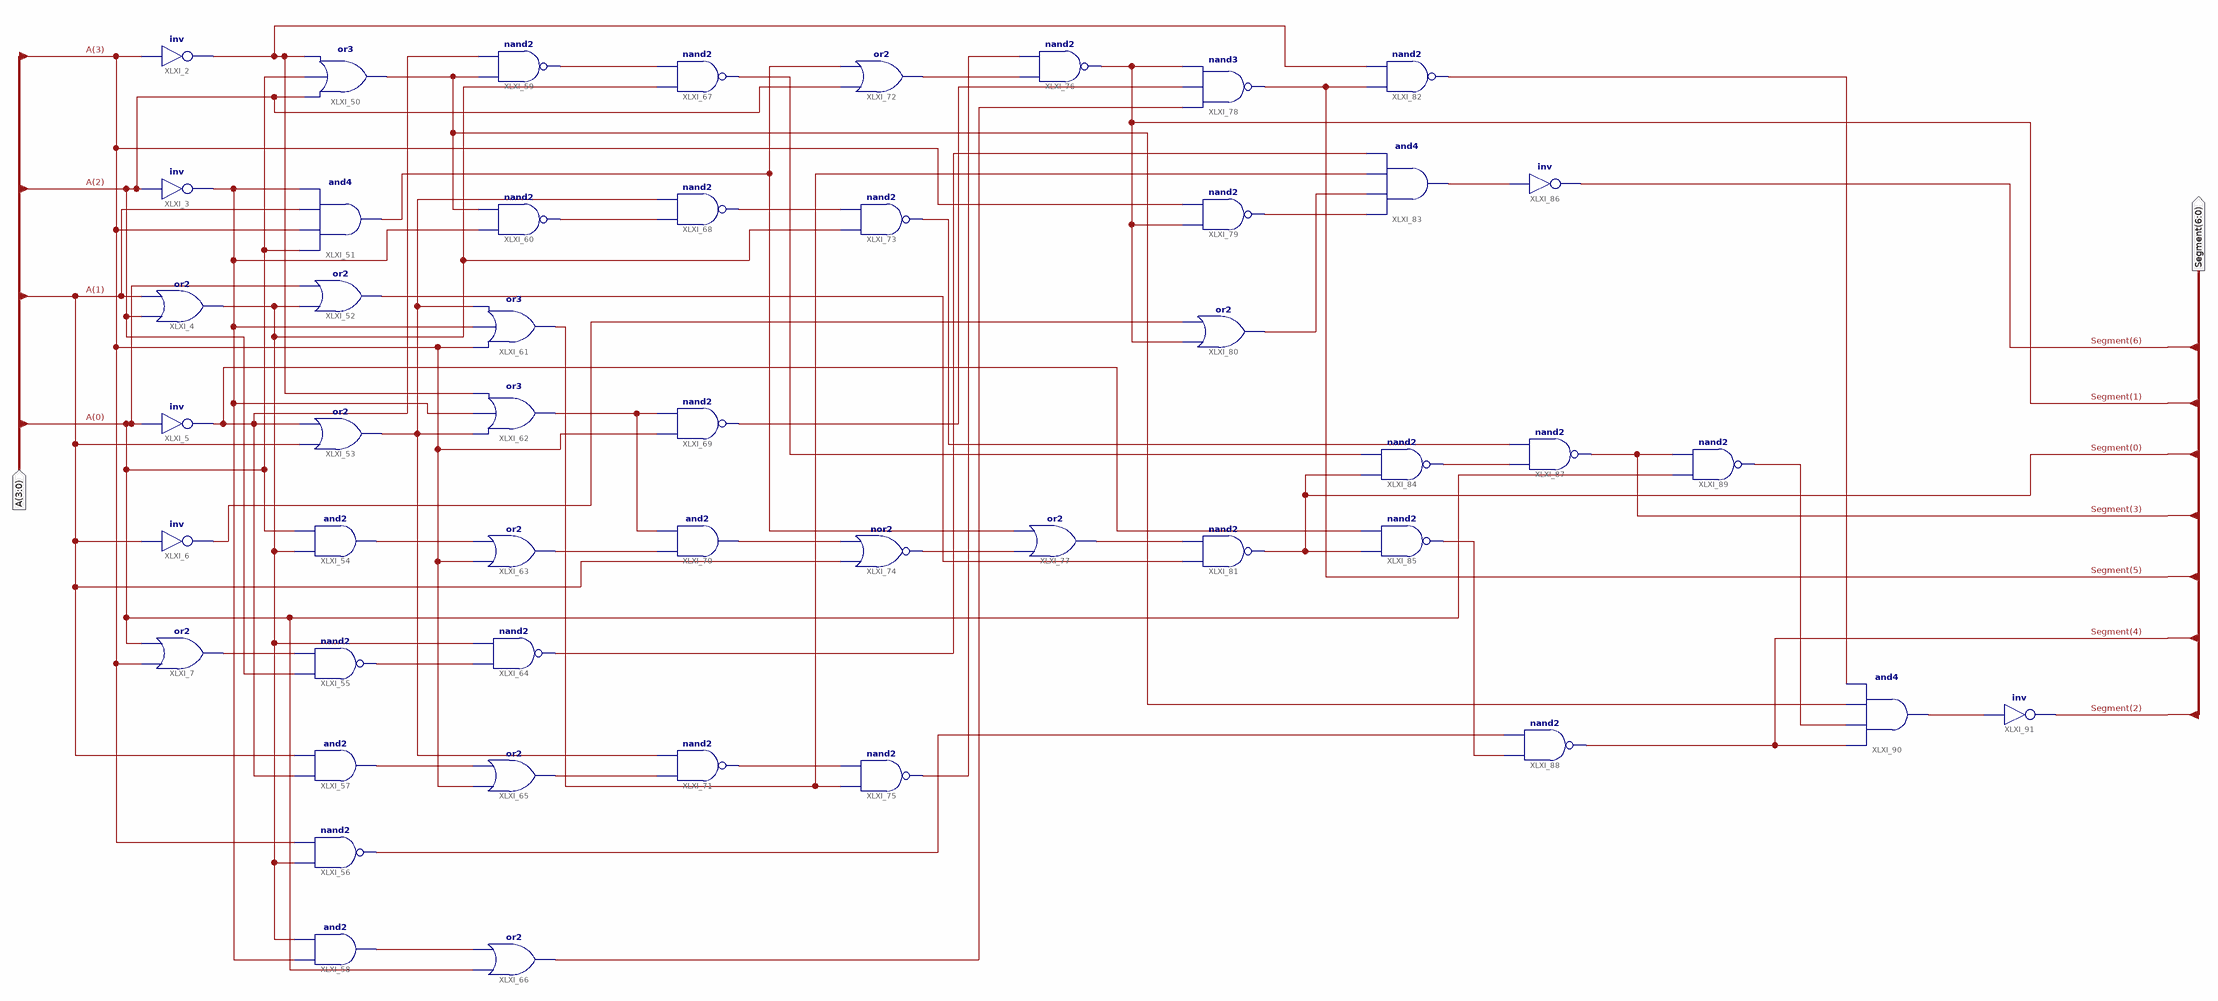
[diagram p0: schematic sheet 1]
// Xilinx ISE schematic ssd1d0fb.sch (spartan6) as structural Verilog: 48 symbols, 2 ports
module ssd1d0fb (
  input  [3:0] A,
  output [6:0] Segment
);

  wire XLXN_26, XLXN_30, XLXN_35, XLXN_37, XLXN_40, XLXN_41, XLXN_43, XLXN_44, XLXN_46, XLXN_47, XLXN_48,
       XLXN_49, XLXN_51, XLXN_52, XLXN_54, XLXN_55, XLXN_56, XLXN_57, XLXN_58, XLXN_59, XLXN_61, XLXN_62,
       XLXN_63, XLXN_65, XLXN_67, XLXN_68, XLXN_71, XLXN_72, XLXN_74, XLXN_75, XLXN_77, XLXN_78, XLXN_79,
       XLXN_82, XLXN_83, XLXN_84, XLXN_85, XLXN_86, XLXN_88, XLXN_90, XLXN_91;

  not XLXI_2 (XLXN_40, A[3]);
  not XLXI_3 (XLXN_35, A[2]);
  or XLXI_4 (XLXN_57, A[2], A[1]);
  not XLXI_5 (XLXN_30, A[0]);
  not XLXI_6 (XLXN_71, A[1]);
  or XLXI_7 (XLXN_26, A[3], A[0]);
  or XLXI_50 (XLXN_37, A[2], A[0], XLXN_40);
  and XLXI_51 (XLXN_55, A[0], A[3], A[1], XLXN_35);
  or XLXI_52 (XLXN_72, XLXN_57, A[0]);
  or XLXI_53 (XLXN_49, A[1], XLXN_30);
  and XLXI_54 (XLXN_41, XLXN_57, A[0]);
  nand XLXI_55 (XLXN_43, A[2], XLXN_26);
  nand XLXI_56 (XLXN_85, XLXN_57, A[3]);
  and XLXI_57 (XLXN_44, XLXN_30, A[1]);
  and XLXI_58 (XLXN_46, XLXN_35, XLXN_57);
  nand XLXI_59 (XLXN_47, XLXN_37, XLXN_30);
  nand XLXI_60 (XLXN_48, XLXN_35, XLXN_37);
  or XLXI_61 (XLXN_77, A[3], XLXN_35, XLXN_49);
  or XLXI_62 (XLXN_52, XLXN_49, XLXN_35, XLXN_40);
  or XLXI_63 (XLXN_51, A[3], XLXN_41);
  nand XLXI_64 (XLXN_78, XLXN_43, XLXN_57);
  or XLXI_65 (XLXN_54, A[3], XLXN_44);
  or XLXI_66 (XLXN_68, A[0], XLXN_46);
  nand XLXI_67 (XLXN_79, XLXN_57, XLXN_47);
  nand XLXI_68 (XLXN_56, XLXN_48, XLXN_49);
  nand XLXI_69 (XLXN_67, A[3], XLXN_52);
  and XLXI_70 (XLXN_58, XLXN_51, XLXN_52);
  nand XLXI_71 (XLXN_59, XLXN_54, XLXN_49);
  or XLXI_72 (XLXN_62, A[2], XLXN_55);
  nand XLXI_73 (XLXN_84, XLXN_57, XLXN_56);
  nor XLXI_74 (XLXN_61, A[1], XLXN_58);
  nand XLXI_75 (XLXN_63, XLXN_77, XLXN_59);
  nand XLXI_76 (Segment[1], XLXN_62, XLXN_63);
  or XLXI_77 (XLXN_65, XLXN_61, XLXN_55);
  nand XLXI_78 (Segment[5], XLXN_68, XLXN_67, Segment[1]);
  nand XLXI_79 (XLXN_74, Segment[1], A[3]);
  or XLXI_80 (XLXN_75, Segment[1], XLXN_71);
  nand XLXI_81 (Segment[0], XLXN_72, XLXN_65);
  nand XLXI_82 (XLXN_90, Segment[5], XLXN_40);
  and XLXI_83 (XLXN_82, XLXN_74, XLXN_75, XLXN_77, XLXN_78);
  nand XLXI_84 (XLXN_83, Segment[0], XLXN_79);
  nand XLXI_85 (XLXN_86, Segment[0], XLXN_30);
  not XLXI_86 (Segment[6], XLXN_82);
  nand XLXI_87 (Segment[3], XLXN_83, XLXN_84);
  nand XLXI_88 (Segment[4], XLXN_86, XLXN_85);
  nand XLXI_89 (XLXN_88, A[0], Segment[3]);
  and XLXI_90 (XLXN_91, Segment[4], XLXN_88, XLXN_37, XLXN_90);
  not XLXI_91 (Segment[2], XLXN_91);
endmodule
